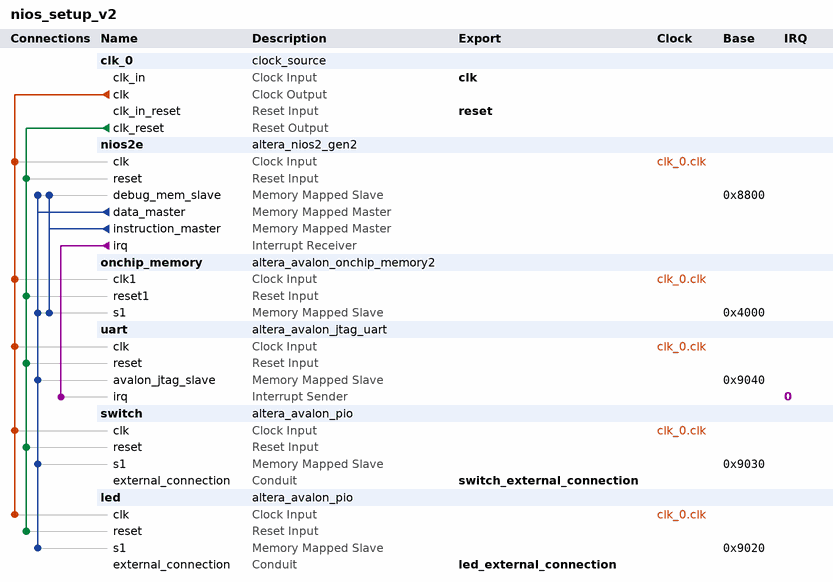
[diagram p0: system contents]
# Platform Designer (Qsys) system nios_setup_v2, MAX 10 10M50DAF484C6GES
# Parameters at their usual value, and those the tool derives, are not listed.
package require -exact qsys 18.1
create_system nios_setup_v2
set_project_property DEVICE_FAMILY {MAX 10}
set_project_property DEVICE 10M50DAF484C6GES

add_instance clk_0 clock_source 18.1
set_instance_parameter_value clk_0 clockFrequency 50000000

add_instance nios2e altera_nios2_gen2 18.1
set_instance_parameter_value nios2e dcache_size 2048
set_instance_parameter_value nios2e exceptionSlave onchip_memory.s1
set_instance_parameter_value nios2e icache_size 4096
set_instance_parameter_value nios2e impl Tiny
set_instance_parameter_value nios2e resetSlave onchip_memory.s1

add_instance onchip_memory altera_avalon_onchip_memory2 18.1
set_instance_parameter_value onchip_memory dataWidth 32
set_instance_parameter_value onchip_memory dualPort false
set_instance_parameter_value onchip_memory initMemContent false
set_instance_parameter_value onchip_memory initializationFileName onchip_mem.hex
set_instance_parameter_value onchip_memory memorySize 16384

add_instance uart altera_avalon_jtag_uart 18.1
set_instance_parameter_value uart simInteractiveOptions NO_INTERACTIVE_WINDOWS

add_instance switch altera_avalon_pio 18.1
set_instance_parameter_value switch direction Input
set_instance_parameter_value switch width 1

add_instance led altera_avalon_pio 18.1
set_instance_parameter_value led direction Output
set_instance_parameter_value led width 1

# connections
add_connection clk_0.clk led.clk clock
add_connection clk_0.clk nios2e.clk clock
add_connection clk_0.clk onchip_memory.clk1 clock
add_connection clk_0.clk switch.clk clock
add_connection clk_0.clk uart.clk clock
add_connection clk_0.clk_reset led.reset reset
add_connection clk_0.clk_reset nios2e.reset reset
add_connection clk_0.clk_reset onchip_memory.reset1 reset
add_connection clk_0.clk_reset switch.reset reset
add_connection clk_0.clk_reset uart.reset reset
add_connection nios2e.data_master led.s1 avalon
set_connection_parameter_value nios2e.data_master/led.s1 baseAddress 0x9020
add_connection nios2e.data_master nios2e.debug_mem_slave avalon
set_connection_parameter_value nios2e.data_master/nios2e.debug_mem_slave baseAddress 0x8800
add_connection nios2e.data_master onchip_memory.s1 avalon
set_connection_parameter_value nios2e.data_master/onchip_memory.s1 baseAddress 0x4000
add_connection nios2e.data_master switch.s1 avalon
set_connection_parameter_value nios2e.data_master/switch.s1 baseAddress 0x9030
add_connection nios2e.data_master uart.avalon_jtag_slave avalon
set_connection_parameter_value nios2e.data_master/uart.avalon_jtag_slave baseAddress 0x9040
add_connection nios2e.instruction_master nios2e.debug_mem_slave avalon
set_connection_parameter_value nios2e.instruction_master/nios2e.debug_mem_slave baseAddress 0x8800
add_connection nios2e.instruction_master onchip_memory.s1 avalon
set_connection_parameter_value nios2e.instruction_master/onchip_memory.s1 baseAddress 0x4000
add_connection nios2e.irq uart.irq interrupt
set_connection_parameter_value nios2e.irq/uart.irq irqNumber 0

# exported interfaces
add_interface clk clock sink
set_interface_property clk EXPORT_OF clk_0.clk_in
add_interface led_external_connection conduit end
set_interface_property led_external_connection EXPORT_OF led.external_connection
add_interface reset reset sink
set_interface_property reset EXPORT_OF clk_0.clk_in_reset
add_interface switch_external_connection conduit end
set_interface_property switch_external_connection EXPORT_OF switch.external_connection

set_interconnect_requirement {$system} qsys_mm.clockCrossingAdapter HANDSHAKE
set_interconnect_requirement {$system} qsys_mm.enableEccProtection FALSE
set_interconnect_requirement {$system} qsys_mm.insertDefaultSlave FALSE
set_interconnect_requirement {$system} qsys_mm.maxAdditionalLatency 1

save_system nios_setup_v2.qsys
